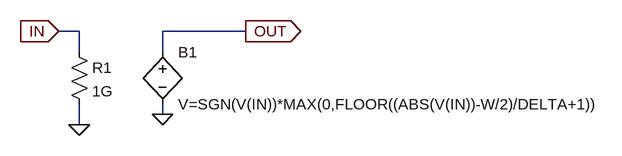
[diagram p0: schematic Quantizer.asc]
Quantizer.asc, the LTspice schematic file:
Version 4
SHEET 1 912 680
WIRE 48 -48 16 -48
WIRE 304 -48 176 -48
WIRE 48 -16 48 -48
WIRE 176 -16 176 -48
WIRE 176 80 176 64
WIRE 48 96 48 64
FLAG 304 -48 OUT
IOPIN 304 -48 Out
FLAG 16 -48 IN
IOPIN 16 -48 In
FLAG 48 96 0
FLAG 176 80 0
SYMBOL res 32 -32 R0
SYMATTR InstName R1
SYMATTR Value 1G
SYMBOL bv 176 -32 R0
SYMATTR InstName B1
SYMATTR Value V=SGN(V(IN))*MAX(0,FLOOR((ABS(V(IN))-W/2)/DELTA+1))

The netlist it stands for:
* Quantizer.asc
R1 IN 0 1G
B1 OUT 0 V=SGN(V(IN))*MAX(0,FLOOR((ABS(V(IN))-W/2)/DELTA+1))
.backanno
.end